# Altium schematic sheet Power.SchDoc
size A4; SheetNumber: 1; SheetTotal: 2
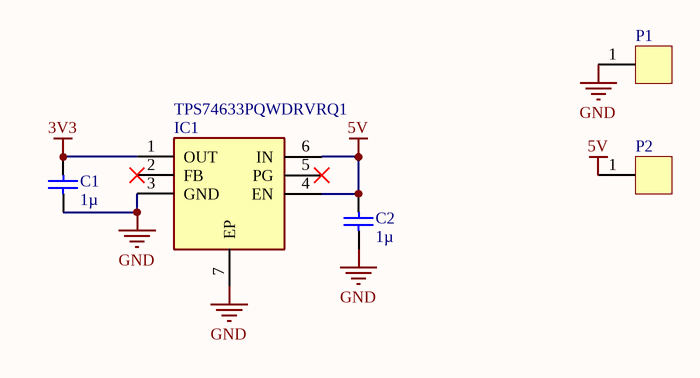
[diagram p0: Power.SchDoc]

## Parts
C1  1µ  [CAPC0603(1608)55_N]
C2  1µ  [CAPC0603(1608)55_N]
IC1  TPS74633PQWDRVRQ1  [SON65P200X200X80-7N]
P1  solder pad square single sided  [solder pad single sided square]  (value not drawn)
P2  solder pad chamfered single sided  [solder pad single sided chamfered]  (value not drawn)

## Nets
3V3: C1.2 IC1.1(OUT)
5V: C2.2 IC1.4(EN) IC1.6(IN) P2.1(upper)
GND: C1.1 C2.1 IC1.3(GND) IC1.7(EP) P1.1(upper)

Not connected (* = marked no-connect by the designer): IC1 2(FB)* 5(PG)*

## Library data of the parts
C1 C2 = Cap 1µ: Keramikvielschichtkondensator, SMD, Baureihe MC, ± 20%; Manufacturer: Multicomp; OC_FARNELL: 1759409; Value: 1µ; PackageReference: 0603
IC1 = TPS74633PQWDRVRQ1: Integrated Circuit; Manufacturer_Name: Texas Instruments; Datasheet Link: https://www.ti.com/lit/gpn/TPS746-Q1; Height: 0.8mm; Manufacturer_Part_Number: TPS74633PQWDRVRQ1; Mouser Part Number: 595-PS74633PQWDRVRQ1; Mouser Price/Stock: https://www.mouser.co.uk/ProductDetail/Texas-Instruments/TPS74633PQWDRVRQ1?qs=%252B6g0mu59x7LGnDdkB7pJpA%3D%3D; Arrow Part Number: TPS74633PQWDRVRQ1; Arrow Price/Stock: https://www.arrow.com/en/products/tps74633pqwdrvrq1/texas-instruments